# EAGLE board evpr_mainboard (EAGLE 9.5.2)
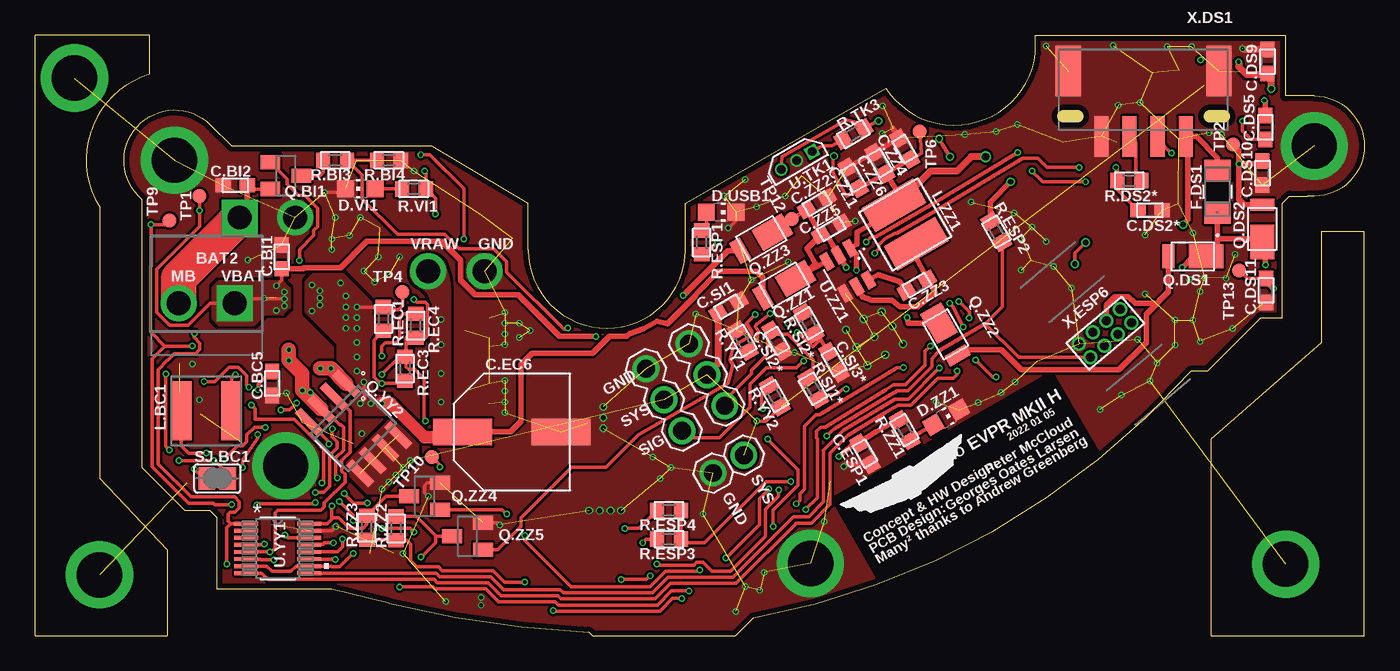
[diagram p2: board, top side]
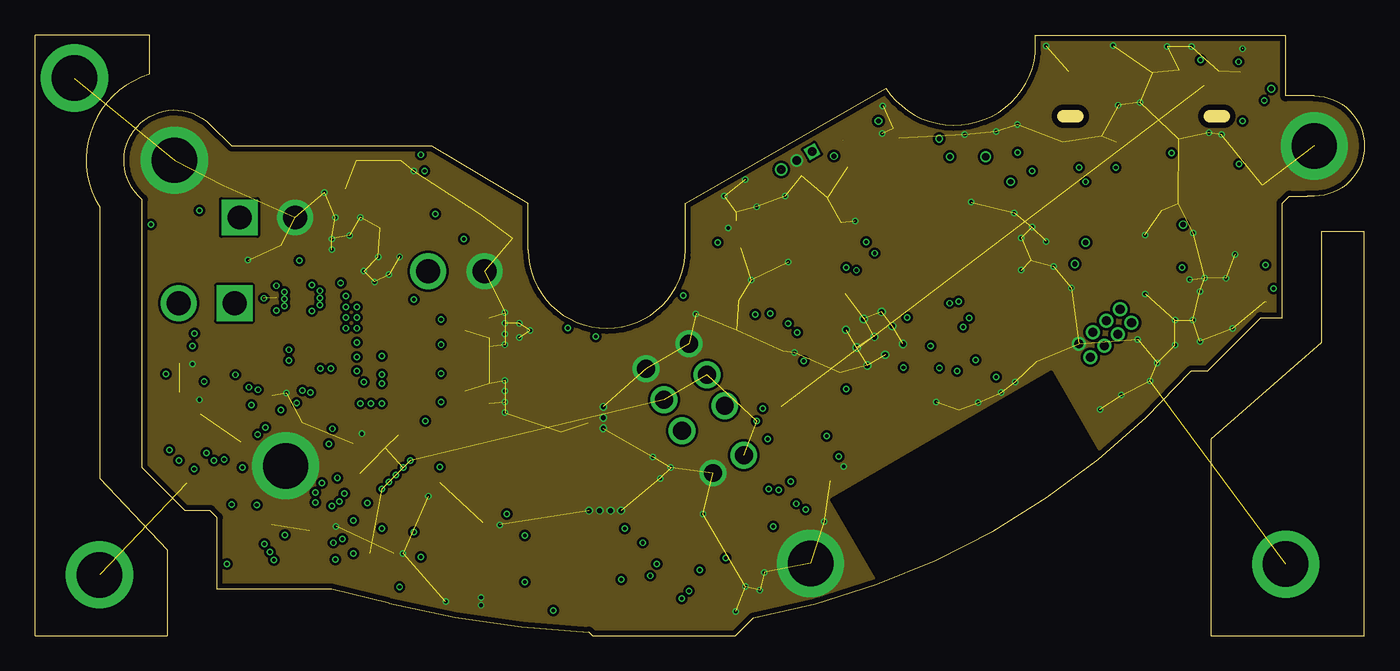
[diagram p3: board, inner layer Route2]
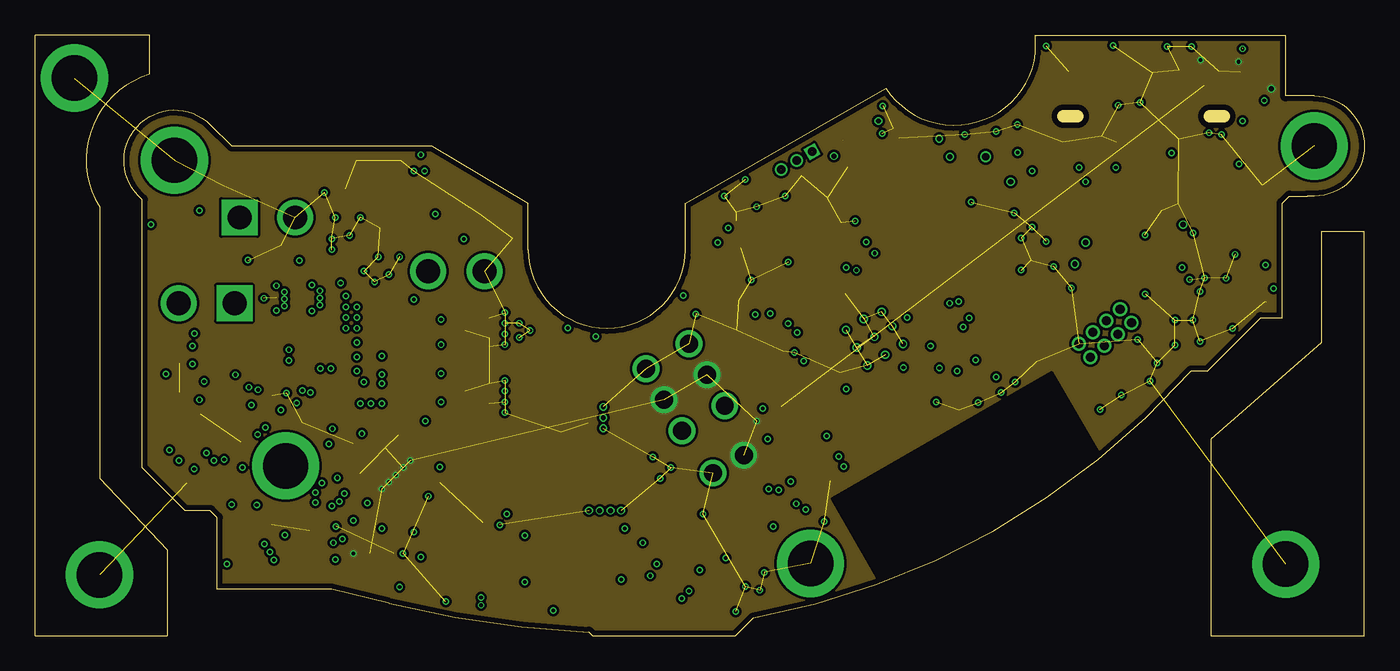
[diagram p4: board, inner layer Route15]
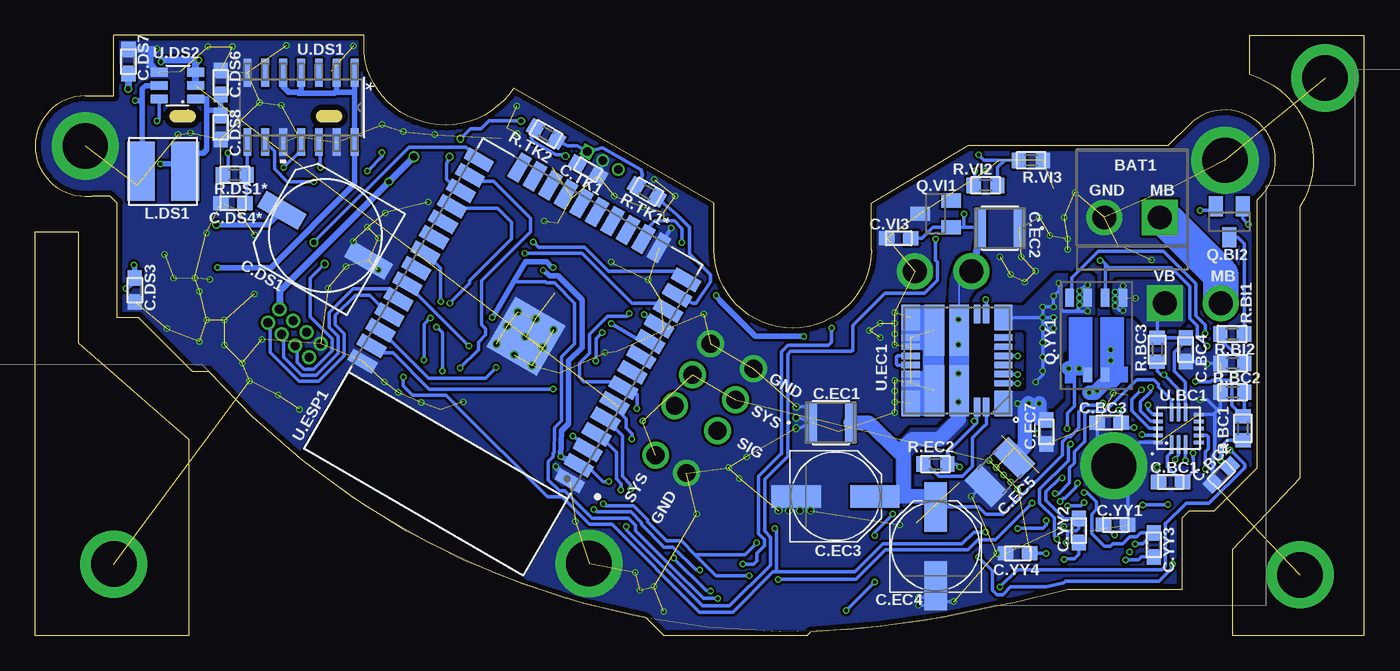
[diagram p5: board, bottom side, seen from below]

Size 94.49 x 42.67 mm. Coordinates in mm from the lower left corner, seen from the top.
Outline: 51.05,1.27 arc38 82.16,18.8 83.31,18.8 87.12,22.61 88.65,22.61 88.65,30.73 89.15,31.24 90.42,31.24 90.93,31.24 arc180 90.93,38.35 88.9,38.35 88.9,42.67 71.12,42.67 71.12,41.4 arc-140 60.48,38.91 46.23,30.73 46.23,27.43 arc-180 35.05,27.43 35.05,30.73 28.19,34.8 13.97,34.8 12.45,36.32 arc185 7.62,30.99 7.62,11.94 10.67,8.89 12.45,8.89 12.95,8.38 12.95,3.3 21.08,3.3 25.15,2.29 arc11 39.37,0.25 39.62,0 49.78,0 51.05,1.27
Outline: 0,0 0,42.67 8.13,42.67 8.13,39.88 arc105 4.57,30.48 4.57,11.18 9.4,6.1 9.4,0 0,0
Outline: 83.57,0 94.49,0 94.49,28.7 91.44,28.7 91.44,20.83 83.57,13.97 83.57,0
Copper layers (1*2*15*16): Top 0.035559375mm / dielectric 0.17018125mm / Route2 0.01778125mm / dielectric 47mil / Route15 0.01778125mm / dielectric 0.17018125mm / Bottom 0.035559375mm
Design rules "oshpark-4layer *": minimum track width 5mil, minimum drill 10mil, track to track 7mil, track to pad 7mil, pad to pad 7mil, via to via 7mil, smd to smd 5mil, copper to edge 15mil, drill to drill 6mil, minimum pad ring 4mil, minimum via ring 4mil, stop-mask expansion 2.5mil, vias tented up to drill 10mil, thermal gap 10mil

## Footprints (pad centres in the part's own frame; a part is rotated, then mirrored left to right if it is on the bottom)
C0603 = smd 1.1 x 1: 1 -0.85,0; 2 0.85,0
810RADCAN = smd 1.3 x 3.3: A$1 0,3.556; C$2 0,-3.556
CAP_3225 = smd 0.75 x 2.794: 1 -1.375,0; 2 1.375,0
OSCON_SVPF_6.3MM = smd 3.5 x 1.6: + 2.8,0; - -2.8,0
C1210 = smd 1.6 x 2.7: 1 -1.4,0; 2 1.4,0
C6CYLCAP = smd 4.2 x 1.9: P$1 -3.5,0; P$2 3.5,0
CHIP-LED0805 = smd 1.2 x 1.2: A 0,-1.05; C 0,1.05
C1-M = smd 1.473 x 1.88: 1 -1.524,0; 2 1.524,0
SRN5040TA = smd 1.5 x 4.2: P$1 -1.8,0; P$2 1.8,0
SRR4818A-XXXX = smd 4.2 x 1.98: P$1 0,1.575; P$2 0,-1.575
SOT23 = smd 1 x 1.4: 1 -0.95,-1.1; 2 0.95,-1.1; 3 0,1.1
SOD-123HE1 = smd 0.85 x 1.7: A 1.725,0 | smd 2.45 x 1.7: C -0.925,0
POWERPAK_SO8DUAL = smd 1.02 x 0.61: D$1B 2.795,0.635; D$2A 2.795,-0.635 | smd 1.27 x 0.61: P$1 -2.67,1.905; P$2 -2.67,0.635; P$3 -2.67,-0.635; P$4 -2.67,-1.905
SOIC8 = smd 0.6 x 2.2: 1 -1.905,-2.6; 2 -0.635,-2.6; 3 0.635,-2.6; 4 1.905,-2.6; 5 1.905,2.6; 6 0.635,2.6; 7 -0.635,2.6; 8 -1.905,2.6
R0603 = smd 1 x 1.1: 1 -0.85,0; 2 0.85,0
SJ = smd 1.168 x 1.6: 1 -0.762,0; 2 0.762,0
MA03-1 = drill 1.27 pad 1.905: 1 -2.54,0; 2 0,0; 3 2.54,0
1X02 = drill 1.27 pad 1.905: 1 -1.27,0; 2 1.27,0
TP10R = smd 1 x 1: TP 0,0
QFN16 = smd 0.25 x 0.7: !ACOK 1,1.45; !EN 0,-1.45; AGND 1,-1.45; BST -0.5,1.45; CELL -1,-1.45; NC 0.5,-1.45; NTC 0.5,1.45; PGND -1,1.45; SEL -0.5,-1.45; TMR 0,1.45 | smd 1.3 x 0.25: !CHOK 1.15,0.5; BAT 1.15,-0.5; CSP 1.15,0; SW -1.15,0.5; VCC -1.15,-0.5; VIN -1.15,0
D14 = smd 1.981 x 0.559: 1 -2.464,3.81; 2 -2.464,2.54; 3 -2.464,1.27; 4 -2.464,0; 5 -2.464,-1.27; 6 -2.464,-2.54; 7 -2.464,-3.81; 8 2.464,-3.81; 9 2.464,-2.54; 10 2.464,-1.27; 11 2.464,0; 12 2.464,1.27; 13 2.464,2.54; 14 2.464,3.81
TSOT23-6 = smd 0.62 x 1.22: 1 -0.95,-1.3; 2 0,-1.3; 3 0.95,-1.3; 4 0.95,1.3; 5 0,1.3; 6 -0.95,1.3
MOL0024A = smd 1.3 x 1.8: 1 -3.3,3.05; 8 -3.3,-3.05; 13 3.3,-3.05; 20 3.3,3.05 | smd 1.3 x 0.45: 2 -3.3,1.625; 3 -3.3,0.975; 4 -3.3,0.325; 5 -3.3,-0.325; 6 -3.3,-0.975; 7 -3.3,-1.625; 14 3.3,-1.625; 15 3.3,-0.975; 16 3.3,-0.325; 17 3.3,0.325; 18 3.3,0.975; 19 3.3,1.625 | smd 0.45 x 1.3: 9 -2.075,-3.3; 10 -1.425,-3.3; 23 -1.425,3.3; 24 -2.075,3.3 | smd 1.4 x 3.6: 11 -0.15,-2.15; 12 1.6,-2.15; 21 1.6,2.15; 22 -0.15,2.15
MODULE_ESP32-WROOM-32D = smd 2 x 0.9: 1 -8.5,5.26; 2 -8.5,3.99; 3 -8.5,2.72; 4 -8.5,1.45; 5 -8.5,0.18; 6 -8.5,-1.09; 7 -8.5,-2.36; 8 -8.5,-3.63; 9 -8.5,-4.9; 10 -8.5,-6.17; 11 -8.5,-7.44; 12 -8.5,-8.71; 13 -8.5,-9.98; 14 -8.5,-11.25; 25 8.5,-11.25; 26 8.5,-9.98; 27 8.5,-8.71; 28 8.5,-7.44; 29 8.5,-6.17; 30 8.5,-4.9; 31 8.5,-3.63; 32 8.5,-2.36; 33 8.5,-1.09; 34 8.5,0.18; 35 8.5,1.45; 36 8.5,2.72; 37 8.5,3.99; 38 8.5,5.26 | smd 0.9 x 2: 15 -5.715,-12.25; 16 -4.445,-12.25; 17 -3.175,-12.25; 18 -1.905,-12.25; 19 -0.635,-12.25; 20 0.635,-12.25; 21 1.905,-12.25; 22 3.175,-12.25; 23 4.445,-12.25; 24 5.715,-12.25 | smd 4.1 x 4.1: 39 -0.68,-2.08
1.27MMHALLEFECT = drill 0.6 square: P$1 1.27,0 | drill 0.6: P$2 0,0; P$3 -1.27,0
MSOP-16_MS-M = smd 1.702 x 0.279: 1 -2.235,1.751; 2 -2.235,1.251; 3 -2.235,0.751; 4 -2.235,0.25; 5 -2.235,-0.25; 6 -2.235,-0.751; 7 -2.235,-1.251; 8 -2.235,-1.751; 9 2.235,-1.751; 10 2.235,-1.251; 11 2.235,-0.751; 12 2.235,-0.25; 13 2.235,0.25; 14 2.235,0.751; 15 2.235,1.251; 16 2.235,1.751
B2P-VH(LF)(SN) = drill 1.7 square: 1 -1.98,0 | drill 1.7: 2 1.98,0
BM04B-PASS-1-TFT(LF)(SN) = smd 1 x 2.9: P$1 -3,2.5; P$2 -1,2.5; P$3 1,2.5; P$4 3,2.5 | smd 1.8 x 3.6: P$5 5.35,-2.15; P$6 -5.35,-2.15
PR20B04HBDN = drill 0.65 pad 1: P$1 -1.905,-0.635; P$2 -1.905,0.635; P$3 -0.635,-0.635; P$4 -0.635,0.635; P$5 0.635,-0.635; P$6 0.635,0.635; P$7 1.905,-0.635; P$8 1.905,0.635
2-THROUGH-HOLE-LARGE-OFFSET = drill 1.7: 1 4,0; 2 0,0

## Placement (x,y rotation side)
C.BC1  0.1uF  [C0603]  13.77,10.92 0 bottom
C.BC2  0.1uF  [C0603]  10.16,11.43 45 bottom
C.BC3  22uF  [C0603]  18.14,15.14 180 bottom
C.BC4  22uF  [C0603]  12.7,20.32 270 bottom
C.BC5  0.47uF  [C0603]  16.84,17.93 90 top
C.BI1  0.1uF  [C0603]  17.53,26.92 90 top
C.BI2  0.1uF  [C0603]  14.22,32 180 top
C.DS1  1000µF  [810RADCAN]  73.86,28.45 60 bottom
C.DS2*  0.1uF  [C0603]  79.25,30.23 0 top
C.DS3  0.1uF  [C0603]  87.4,24.56 90 bottom
C.DS4*  0.1uF  [C0603]  80.42,30.72 180 bottom
C.DS5  0.1uF  [C0603]  87.45,36.12 90 top
C.DS6  22uF  [C0603]  81.31,39.32 90 bottom
C.DS7  10uF  [C0603]  87.86,40.79 90 bottom
C.DS8  22uF  [C0603]  81.31,36.12 270 bottom
C.DS9  0.1uF  [C0603]  87.6,40.79 270 top
C.DS10  0.1uF  [C0603]  87.25,32.87 90 top
C.DS11  0.1uF  [C0603]  87.5,24.54 90 top
C.EC1  10µF  [CAP_3225]  37.92,15.14 0 bottom
C.EC2  10µF  [CAP_3225]  25.91,28.96 180 bottom
C.EC3  56µF  [OSCON_SVPF_6.3MM]  37.59,9.91 0 bottom
C.EC4  56µF  [OSCON_SVPF_6.3MM]  30.48,6.35 90 bottom
C.EC5  47µF  [C1210]  25.91,11.63 225 bottom
C.EC6  220µF  [C6CYLCAP]  33.88,14.48 180 top
C.EC7  0.1uF  [C0603]  22.61,14.48 90 bottom
C.ESP1  0.1uF  [C0603]  58.98,12.93 120 top
C.SI1  0.1uF  [C0603]  49.28,23.37 210 top
C.SI2*  0.1uF  [C0603]  52.73,20.95 300 top
C.SI3*  0.1uF  [C0603]  56.79,19.43 300 top
C.TK1  0.1uF  [C0603]  55.19,33.12 150 bottom
C.VI3  0.1uF  [C0603]  33.1,28.24 180 bottom
C.YY1  0.1uF  [C0603]  17.68,7.87 0 bottom
C.YY2  56 nF  [C0603]  20.29,7.47 90 bottom
C.YY3  56 nF  [C0603]  14.96,6.45 270 bottom
C.YY4  0.1uF  [C0603]  24.64,5.84 180 bottom
C.ZZ1  22uF  [C0603]  58.17,32.54 120 top
C.ZZ2  10uF  [C0603]  55.57,30.7 30 top
C.ZZ3  0.1uF  [C0603]  62.68,24.91 30 top
C.ZZ4  22uF  [C0603]  61.81,34.6 120 top
C.ZZ5  0.1uF  [C0603]  56.58,28.9 210 top
C.ZZ6  0.1uF  [C0603]  60.05,33.58 300 top
D.USB1  [CHIP-LED0805]  48.76,30.1 270 top
D.VI1  [CHIP-LED0805]  23.11,31.75 90 top
D.ZZ1  [CHIP-LED0805]  64.77,15.52 300 top
F.DS1  1A  [C1-M]  84.05,31.55 90 top
L.BC1  33uH  [SRN5040TA]  12.17,15.98 0 top
L.DS1  4.7µH  [SRR4818A-XXXX]  85.39,32.99 90 bottom
L.ZZ1  3.9µH  [SRR4818A-XXXX]  61.85,29.22 210 top
Q.BI1  BSS84-7-F  [SOT23]  17.83,32.69 270 top
Q.BI2  BSS84-7-F  [SOT23]  9.6,29.41 180 bottom
Q.DS1  SMD34LHE1  [SOD-123HE1]  82.3,26.95 180 top
Q.DS2  SMD34LHE1  [SOD-123HE1]  87.22,28.91 90 top
Q.VI1  [SOT23]  30.48,29.97 90 bottom
Q.YY1  SI7997DP  [POWERPAK_SO8DUAL]  19.05,21.34 270 bottom
Q.YY2  CSD88537NDT  [SOIC8]  22.61,14.73 225 top
Q.ZZ1  SMD34LHE1  [SOD-123HE1]  53.24,24.92 210 top
Q.ZZ2  SMD34LHE1  [SOD-123HE1]  64.72,21.41 300 top
Q.ZZ3  SMD34LHE1  [SOD-123HE1]  51.61,28.22 210 top
Q.ZZ4  DMN5L06K-7  [SOT23]  27.69,9.91 90 top
Q.ZZ5  DMN5L06K-7  [SOT23]  30.73,7.06 90 top
R.BC1  100k  [R0603]  8.64,14.73 270 bottom
R.BC2  100k  [R0603]  9.37,17.3 0 bottom
R.BC3  0.25  [R0603]  14.73,20.32 90 bottom
R.BI1  47.5k  [R0603]  9.4,21.44 0 bottom
R.BI2  22.1k  [R0603]  9.37,19.35 0 bottom
R.BI3  47.5k  [R0603]  21.34,33.78 180 top
R.BI4  22.1k  [R0603]  25.15,33.78 180 top
R.DS1*  0  [R0603]  80.29,32.74 0 bottom
R.DS2*  0  [R0603]  77.77,32.33 180 top
R.EC1  10k 0.1%  [R0603]  24.77,22.5 270 top
R.EC2  37.4kΩ 1%  [R0603]  30.48,12.19 180 bottom
R.EC3  768Ω 0.1%  [R0603]  26.29,18.97 270 top
R.EC4  95.3kΩ  [R0603]  27.05,22.02 270 top
R.ESP1  250Ω  [R0603]  47.37,27.94 270 top
R.ESP2  10k  [R0603]  68.33,28.7 300 top
R.ESP3  100k  [R0603]  45.06,6.85 180 top
R.ESP4  100k  [R0603]  45.06,8.9 180 top
R.SI1*  0  [R0603]  55.3,17.55 300 top
R.SI2*  0  [R0603]  54.99,22.2 120 top
R.TK1*  0  [R0603]  51,31.55 330 bottom
R.TK2  0  [R0603]  58.17,35.64 150 bottom
R.TK3  100k  [R0603]  58.17,35.64 30 top
R.VI1  500  [R0603]  26.92,31.75 0 top
R.VI2  100k  [R0603]  26.92,32 180 bottom
R.VI3  22.1k  [R0603]  23.7,33.78 180 bottom
R.YY1  22.1k  [R0603]  50.29,20.95 300 top
R.YY2  100k  [R0603]  52.58,17.02 300 top
R.ZZ1  250Ω  [R0603]  61.8,14.6 120 top
R.ZZ2  100k  [R0603]  25.65,7.62 90 top
R.ZZ3  100k  [R0603]  23.57,7.67 90 top
SJ.BC1  [SJ]  12.95,11.18 0 top
SV1  [MA03-1]  44.7,16.76 120 top
SV2  [MA03-1]  47.75,18.54 120 top
SV3  [1X02]  49.28,12.19 30 top
TP1  PTR1TP10R  [TP10R]  11.68,31.24 90 top
TP2  PTR1TP10R  [TP10R]  85.14,34.9 90 top
TP4  PTR1TP10R  [TP10R]  26.11,24.43 180 top
TP6  PTR1TP10R  [TP10R]  62.89,35.81 0 top
TP9  PTR1TP10R  [TP10R]  9.55,29.51 90 top
TP10  PTR1TP10R  [TP10R]  28.19,12.7 180 top
TP12  PTR1TP10R  [TP10R]  53.77,29.6 30 top
TP13  PTR1TP10R  [TP10R]  85.6,25.96 90 top
U.BC1  MP2615  [QFN16]  13.21,14.73 90 bottom
U.DS1  SN74AHCT125DR  [D14]  75.59,37.54 270 bottom
U.DS2  [TSOT23-6]  84.38,39.09 90 bottom
U.EC1  TPSM84824MOLR  [MOL0024A]  28.96,19.56 180 bottom
U.ESP1  ESP32-WROOM-32D  [MODULE_ESP32-WROOM-32D]  61.21,19.81 150 bottom
U.TK1  HALLEFFECT  [1.27MMHALLEFECT]  54.13,33.76 30 top
U.YY1  LTC4353CMSPBFMSOP-16_MS-M  [MSOP-16_MS-M]  17.25,6.2 0 top
U.ZZ1  [TSOT23-6]  57.75,25.93 210 top
X.BI1  B2P-VH(LF)(SN)  [B2P-VH(LF)(SN)]  12.19,23.62 180 top
X.BI2  B2P-VH(LF)(SN)  [B2P-VH(LF)(SN)]  16.51,29.72 180 bottom
X.DS1  BM04B-PASS-1-TFT(LF)(SN)  [BM04B-PASS-1-TFT(LF)(SN)]  78.79,37.97 180 top
X.ESP6  PR20B04HBDN  [PR20B04HBDN]  76.07,21.49 40 top
X.VI1  2-THROUGHOLE-OFFSET  [2-THROUGH-HOLE-LARGE-OFFSET]  27.94,25.91 0 top

## Tracks (layer width: path | path; a pad name or v marks a point on that pad's centre or on a via)
5.0V  (via drill 0.25)
  Top 0.254: TP13.TP 86.16,25.4 87.47,25.4 C.DS11.2
  Top 0.381: v81.53,26.16 82.32,26.95 Q.DS1.C 84.05,27.78 84.05,28.19 | F.DS1.1 84.05,28.19 | 84.05,28.19 87.01,28.19 Q.DS2.C 87.45,27.75 v87.45,26.34 | v88.02,24.67 87.47,25.22 87.47,25.4
  Bottom 0.381: 71.78,38.61 U.DS1.14 71.78,32.11 77.72,26.16 v81.53,26.16 | 71.78,38.61 U.DS1.1 | U.DS1.5 76.86,39.01 76.45,38.61 75.69,38.61 | 71.78,38.61 73.15,38.61 | U.DS1.2 73.05,38.71 73.15,38.61 | 73.15,38.61 73.2,38.56 75.74,38.56 75.69,38.61 | U.DS1.4 75.59,38.71 75.69,38.61 | v87.45,26.34 87.4,26.29 C.DS3.2 87.4,25.29 v88.02,24.67
!ACOK  (via drill 0.25)
  Top 0.254: v15.38,16.4 15.65,16.13 15.65,15.36 18.43,15.36 19.86,13.93 19.89,13.93 20.34,13.48 20.34,13.39 20.5,13.24 20.5,10.95 v20.4,10.85 | v21.64,9.52 22.61,8.56 v22.61,8.18 | v24.64,7.62 26.67,7.62 v26.92,7.37 | v65.66,23.75 66.4,23.01 v66.4,22.59 | v68.33,18.38 68.07,18.38 v66.84,19.6 | R.ESP4.2 42.92,7.62 v41.91,7.62
  Bottom 0.254: U.BC1.!ACOK 15.02,15.73 15.38,16.09 v15.38,16.4 | v20.4,10.85 20.52,10.72 20.52,10.53 21.3,9.76 21.41,9.76 v21.64,9.52 | v22.61,8.18 22.61,7.87 22.86,7.62 v24.64,7.62 | v26.92,7.37 27.76,7.37 28.6,6.53 34.22,6.53 36.2,4.54 41.66,4.54 | U.ESP1.31 65.66,26.11 v65.66,23.75 | v66.4,22.59 66.84,22.15 v66.84,19.6 | v68.33,18.38 68.33,17.75 67.67,17.09 65.28,17.09 64.59,16.41 64.59,16.39 58.06,9.86 57.03,9.86 55.09,7.92 53.49,7.92 47.25,1.68 44.89,1.68 42.03,4.54 41.66,4.54 | v41.91,7.62 41.78,7.49 41.78,4.67 41.66,4.54
!BAT_EN  (via drill 0.25)
  Top 0.254: Q.BI1.1 17.93,32.45 17.93,32.06 18.69,31.3 19.14,31.3 20.07,30.37 20.07,29.06 19.81,28.81 19.81,28.45 18.8,27.43 v18.8,26.67 | Q.ZZ4.3 24.96,9.91 R.ZZ3.2 23.57,7.91 23.3,7.65 22.33,7.65 21.59,8.38 21.19,8.38 | 21.19,8.38 21.08,8.38 v21.08,9.22 | 21.19,8.38 20.75,7.95 U.YY1.16 | v11.18,20.57 9.22,20.57 | 9.22,20.57 8.32,19.68 8.32,11.99 10.9,9.41 12.66,9.41 12.76,9.31 v13.97,9.31 | 9.22,20.57 8.2,21.59 8.2,26.23 8.24,26.27 v8.24,29.21 9.25,29.21 TP9.TP | v15.75,9.27 15.85,9.37 18.92,9.37 18.93,9.38 19.84,9.38 v19.91,9.46
  Bottom 0.254: Q.YY1.P$2 18.41,26.42 | v18.8,26.67 18.67,26.67 18.41,26.42 | 18.41,26.42 18.16,26.16 13.73,26.16 12.4,24.83 12.4,22.56 11.86,22.02 11.86,21.26 v11.18,20.57 | Q.BI2.1 8.65,29.62 v8.24,29.21 | v13.97,9.31 15.71,9.31 v15.75,9.27 | v21.08,9.22 20.15,9.22 v19.91,9.46
!CHGOK  (via drill 0.25)
  Top 0.254: v61.72,19.05 61.21,19.05 61.15,18.98 55.76,15.69 55.5,15.69 54.83,15.02 54.68,14.87 54.68,10.39 54.37,10.08 54.37,9.64 v54.1,9.37 | v21.98,10.09 22.64,9.43 v23.62,9.43 | v43.73,4.26 43.48,4.01 v41.66,4.01 | v43.18,6.6 43.43,6.85 R.ESP3.2
  Bottom 0.254: U.ESP1.36 66.52,18.29 62.48,18.29 v61.72,19.05 | U.BC1.!CHOK 13.71,16.76 14.66,17.7 14.66,17.87 14.97,18.19 16.15,18.19 18.4,15.94 19.66,15.94 19.86,15.74 19.86,13.81 20.61,13.07 20.61,12.27 20.96,11.92 20.96,10.86 21.73,10.09 v21.98,10.09 | v23.62,9.43 26.22,6.83 27.46,6.83 28.19,6.1 34.04,6.1 36.13,4.01 v41.66,4.01 | 54.1,9.4 v54.1,9.37 53.95,9.22 51.95,9.22 50.95,8.22 50.95,8.08 49.6,6.73 48.54,6.73 47.58,5.76 | v43.73,4.26 46.07,4.26 47.58,5.76 | 47.58,5.76 44.02,5.76 v43.18,6.6
!ENG_EN  (via drill 0.25)
  Top 0.254: Q.ZZ5.3 28.45,7.06 | R.ZZ2.2 27.09,8.47 28.45,7.11 28.45,7.06 | v11.31,21.46 11.31,21.2 11.71,20.8 11.71,20.35 11.4,20.04 9.89,20.04 9.41,19.56 9.4,19.56 8.75,18.91 8.75,12.19 11.08,9.87 14.17,9.87 14.5,9.53 14.5,9.09 14.19,8.78 13.86,8.78 13.72,8.64 13.72,8.36 13.73,8.34 13.73,8.13 13.91,7.95 | 13.91,7.95 U.YY1.1 15.68,7.95 | 13.91,7.95 13.62,7.66 v13.62,5.08 | 28.45,7.06 28.45,6.6 v27.43,5.59
  Bottom 0.254: v11.31,21.46 v11.3,21.46 11.3,22.07 11.97,22.74 11.97,25.01 14.29,27.33 18.89,27.33 20.78,25.44 20.78,24.18 Q.YY1.P$4 | v13.62,5.08 13.72,4.98 13.72,4.75 14.61,3.86 21.26,3.86 21.35,3.77 22.6,3.46 25.15,3.46 25.69,2.92 26.13,2.92 26.44,3.24 26.44,4.6 v27.43,5.59
!USING_BAT  (via drill 0.25)
  Top 0.254: U.YY1.9 22.93,4.45 28.5,4.45 28.77,4.18 32.39,4.18 33.3,3.28 37.33,3.28 37.56,3.04 43.88,3.04 44.98,4.14 49.6,4.14 53.9,8.44 54.99,8.44 56.05,9.5 56.05,13.17 57.47,14.59 61.13,16.82 62.07,16.82 64.18,18.92 v64.28,19.02
  Bottom 0.254: v64.28,19.02 62.97,20.33 62.97,20.86 62.46,21.37 62.46,21.81 62.74,22.09 62.74,25.21 59.26,28.69 59.26,29.65 61.91,32.3 63.18,32.3 U.ESP1.26
!USING_ENG  (via drill 0.25)
  Top 0.254: U.YY1.8 16.1,4.45 16.55,3.99 28.35,3.99 28.59,3.75 32.21,3.75 33.12,2.84 37.15,2.84 37.38,2.61 44.05,2.61 45.16,3.71 49.81,3.71 54.1,8 | 54.08,8 54.1,8 | 54.1,8 55.17,8 56.49,9.33 56.49,12.97 57.77,14.25 60.41,15.83 61.32,16.38 62.25,16.38 64.16,18.29 65.28,18.29 65.53,18.54 v65.53,18.82 | v65.02,23.62 65.23,23.42 v65.96,21.95
  Bottom 0.254: v65.53,18.82 65.53,21.51 v65.96,21.95 | v65.02,23.62 63.6,25.04 63.6,25.22 60.63,28.19 60.63,29.39 61.63,30.39 64.72,30.39 64.84,30.5 U.ESP1.28
AGND  (via drill 0.25)
  Top 0.254: v24.64,18.57 25.89,19.82 R.EC3.1 26.38,19.92 | v26.92,23.88 27.12,23.68 27.73,23.68 27.91,23.5 27.91,21.34 27.74,21.17 R.EC4.2 26.38,21.17 26.38,19.92 | v27.73,15.25 27.65,15.34 27.65,18.24 26.96,18.93 26.54,18.93 26.38,19.08 26.38,19.92 | TP10.TP 28.75,12.14 v28.75,11.99
  Bottom 0.254: U.EC1.3 24.64,18.58 v24.64,18.57 | U.EC1.23 27.53,15.14 | U.EC1.9 26.88,23.83 v26.92,23.88 | 27.53,15.14 29.63,13.04 R.EC2.1 28.96,12.19 v28.75,11.99 | 27.53,15.14 27.64,15.25 v27.73,15.25
BAT_EN  (via drill 0.25)
  Top 0.254: v54.77,8.97 55.61,9.81 55.61,14 55.55,14.07 55.55,14.52 55.86,14.83 56.2,14.83 56.25,14.85 56.23,14.85 60.49,17.47 61.01,17.83 61.87,17.83 63.26,19.23 63.26,20.2 v63.64,20.58 | Q.ZZ4.1 33.21,8.96 v33.53,8.64 | 34.84,7.12 v34.8,7.12 34.8,6.77 38.1,3.47 43.7,3.47 44.8,4.57 47.14,4.57 v47.24,4.67
  Bottom 0.254: v54.77,8.97 54.59,8.79 52.13,8.79 51.38,8.04 51.38,7.9 49.78,6.3 49.13,6.3 47.51,4.67 v47.24,4.67 | U.ESP1.33 68.03,24.97 v63.64,20.58 | v33.53,8.64 34.8,7.37 v34.8,7.12
BATSENSE1  (via drill 0.25)
  Top 0.254: v9.29,18.6 9.29,13.45 v9.56,13.18 | v25.91,3.46 28.27,3.46 28.41,3.32 32.03,3.32 32.94,2.41 36.97,2.41 37.2,2.18 44.23,2.18 45.23,3.17 v46.48,3.17 | v52.16,10.41 51.49,9.74 51.49,7.9 v49.1,5.51
  Bottom 0.254: R.BI1.1 10.25,21.08 R.BI2.2 v9.28,18.6 v9.29,18.6 | v9.56,13.18 9.5,13.18 8.51,12.19 8.51,11.94 11.04,9.41 12.66,9.41 14.09,7.98 14.16,7.98 14.16,4.92 14.38,4.7 24.67,4.7 v25.91,3.46 | v52.16,10.41 52.16,10.73 52.74,11.31 52.74,14.21 U.ESP1.5 | v46.48,3.17 46.77,3.17 v49.1,5.51
BATSENSE2  (via drill 0.25)
  Top 0.254: R.BI4.2 R.BI3.1 23.26,32.71 23.26,31.02 25.77,28.52 29.11,28.52 30.13,27.49 32.59,27.49 33.52,26.56 33.52,25.83 37.59,21.76 37.76,21.76 v37.86,21.86 | v52.85,10.34 52.85,9.92 51.92,8.99 51.92,7.07 49.42,4.57 48.1,4.57 47.47,5.21 47.02,5.21 46.82,5 44.27,5 v44.2,5.08
  Bottom 0.254: U.ESP1.4 54.44,14.31 53.18,13.04 53.18,11.13 52.85,10.8 v52.85,10.34 | v37.86,21.86 37.86,20.85 38.08,20.63 40.96,20.63 41.42,20.17 41.42,12.95 | 41.42,12.95 41.42,12.94 | 41.42,12.95 43.05,11.32 43.05,7.23 42.65,6.83 42.65,6.38 43.18,5.85 43.18,5.33 43.43,5.08 v44.2,5.08
BOOTMODE  (via drill 0.38)
  Top 0.254: v73.91,26.42 73.91,27.18 v74.68,27.94
  Bottom 0.254: X.ESP6.P$3 75.85,20.45 75.85,19.43 75.37,18.95 74.68,18.95 73.38,20.25 73.38,21.09 74.93,22.65 74.93,25.4 v73.91,26.42 | v74.68,27.94 67.9,34.72 64.77,34.72 64.14,34.72 63.87,34.72 U.ESP1.25
DS_CLK  (via drill 0.25)
  Top 0.254: v59.07,27.98 59.43,28.35 59.78,28.35 63.64,30.57 69.81,34.31 v69.83,34.32 | v74.68,32.26 71.63,32.26 v70.87,33.02
  Bottom 0.254: v59.07,27.98 58.69,27.61 55.44,27.61 53.75,25.91 48.83,25.91 U.ESP1.14 | U.DS1.9 77.47,34.42 77.47,33.16 76.56,32.26 v74.68,32.26 | v70.87,33.02 69.83,34.06 v69.83,34.32
DS_DAT  (via drill 0.25)
  Top 0.254: v59.67,27.18 60,27.5 60,27.8 60.41,28.21 61.11,28.61 61.28,28.61 63.9,30.13 70.22,33.93 71.27,33.93 71.93,33.27 v74.22,33.27
  Bottom 0.254: U.ESP1.12 50.01,23.61 52.06,23.61 55.62,27.18 v59.67,27.18 | U.DS1.12 74.22,34.98 v74.22,33.27
ENG_EN  (via drill 0.25)
  Top 0.254: Q.ZZ5.1 32.88,6.11 34.54,7.78 34.54,8.38 38.12,11.95 40.58,11.95 42.89,14.26 49.25,17.94 49.6,19.25 49.39,19.61 49.66,20.61 50.89,21.31 50.95,21.55 50.57,22.2 v51.18,22.81
  Bottom 0.254: v51.18,22.81 50.38,22.01 U.ESP1.11
ESP_POWER  (via drill 0.25, 0.35, 0.38, 0.51)
  Top 0.254: TP6.TP 62.99,34.29 62.36,33.86 C.ZZ4.1 | v53.71,10.95 51.94,10.95 47.6,6.6 46.15,6.6 R.ESP3.1 R.ESP4.1 | C.ZZ1.1 57.66,31.24 56.71,32.91 56.71,34.04 v56.78,34.08
  Top 0.381: C.ZZ6.2 C.ZZ4.1 | C.ZZ6.2 61.65,30.98 61.53,30.9 L.ZZ1.P$2 60.75,30.4 60.56,30.29 59.62,29.35 58.42,28.66 58.42,27.8 U.ZZ1.1 58.39,27.07 v58.39,25.97 | C.ZZ1.1 C.ZZ6.2 | v57.12,12.73 58.25,13.66 C.ESP1.2 58.69,13.8 59.76,14.49 R.ZZ1.2 61.35,15.32 | R.ESP2.1 67.9,30.82 v69.34,32.26
  Top 0.508: v67.56,34.04 66.55,34.04 65.53,33.02 63.65,33.02 61.53,30.9
  Bottom 0.254: v53.71,10.95 54.13,10.95 55.29,12.11 U.ESP1.2 | v56.78,34.08 56.86,34.16 57.46,34.16 59.12,35.14 59.23,35.43 R.TK2.2
  Bottom 0.381: U.ESP1.2 55.99,12.24 v57.12,12.73 57.08,14.55 56.56,15.07 56.56,19.53 55.63,20.47 55.63,23.88 57.31,25.57 57.93,25.57 58.33,25.97 v58.39,25.97
  Bottom 0.508: X.ESP6.P$8 77.12,24.48 v69.34,32.26 v67.56,34.04
ESP_RX
  Bottom 0.254: U.ESP1.34 69.4,24.64 71.88,24.64 73.58,22.94 73.58,21.91 72.94,21.27 72.94,20.07 74.5,18.52 75.55,18.52 76.83,19.8 76.83,21.27 X.ESP6.P$5
ESP_TX
  Bottom 0.254: U.ESP1.35 70.7,24.21 71.7,24.21 73.15,22.76 73.15,22.09 72.51,21.45 72.51,19.89 74.32,18.08 75.72,18.08 77.8,20.16 77.8,22.08 X.ESP6.P$7
GND  (via drill 0.25, 0.35, 0.38, 3.23 pad 4.78)  (164 unrouted)
  Top 0.254: 49.81,29.49 v49.28,28.96 | 19.5,7.46 U.YY1.15 21.06,7.45 v21.39,7.77 | D.VI1.C 21.81,31.5 v20.57,31.5 | Q.ZZ4.2 27.87,10.86 27.69,10.67 27.69,10.16 v27.94,9.91 | Q.ZZ5.2 32.88,8.01 v33.02,7.87
  Top 0.381: 60.96,36.07 C.ZZ4.2 C.ZZ6.1 C.ZZ1.2 | v57.48,12.01 57.66,12.19 C.ESP1.1
  Top 0.508: C.DS9.1 85.91,41.64 85.84,41.72
  Bottom 0.254: 17.73,11.99 v17.8,12.06 18.99,13.24 C.BC3.2 | v49.28,28.96 U.ESP1.15 | v20.57,31.5 20.66,31.58 | U.BC1.AGND 10.68,15.73 10.41,16 | 10.41,16 10.22,16.19 R.BC2.1 10.22,16.23 10.62,15.84 10.62,12.9 10.76,12.76 C.BC2.1 | 10.41,16 11.18,16.76 v11.68,16.76 | R.BI2.1 11.12,19.35 v11.18,19.3 11.34,19.47 C.BC4.2 | U.BC1.PGND 15.99,13.73 17.73,11.99 | C.EC7.1 22.61,13.74 v23.22,14.35 | C.YY4.2 v26.15,5.84 | C.EC5.2 27.2,10.64 v27.94,9.91 | 30.48,2.79 C.EC4.- | v29.19,2.41 30.1,2.41 30.48,2.79 | v31.7,2.16 31.12,2.16 30.61,2.67 | 30.61,2.67 30.48,2.79 | v31.7,2.72 30.66,2.72 30.61,2.67 | C.YY1.2 16.83,11.09 17.73,11.99 | v40.39,15.49 40.16,15.49 C.EC1.1 | v40.39,14.73 40.21,14.73 C.EC1.1 | v39.37,8.89 C.EC3.- | v40.13,8.89 40.13,9.65 C.EC3.- | v40.89,8.89 40.89,9.4 C.EC3.- | v41.66,8.89 40.64,9.91 C.EC3.- | 39.88,16.26 v40.39,16.26 39.12,16.26 39.12,15.32 C.EC1.1 | U.TK1.P$2 C.TK1.1
  Bottom 0.381: U.ESP1.1 v57.48,12.01
  Bottom 0.508: C.DS7.2 85.89,41.64 v85.83,41.71 86.36,41.17 86.36,40.62 85.78,40.04 U.DS2.4
  other vias: 9.91,33.78 55.12,5.13 90.93,34.8 57.63,21.74 58.39,20.47 59.16,19.2 60.43,19.96 59.66,21.23 58.9,22.5 60.17,23.01 60.93,22 61.7,20.73 49.81,1.73 51.84,4.5 56.08,8.1 67.03,16.56 68.66,17.27 64.06,16.61 53.54,26.54 58.29,29.46 71.86,41.91 76.63,41.94 80.47,41.86 82.19,41.86 78.54,37.9 76.99,37.69 83.44,35.74 84.33,35.61 85.29,27.1 82.32,28.6 78.89,28.47 78.38,21.06 78.92,24.28 82.07,25.3 83.13,25.43 82.8,24.46 85.12,21.82 84.66,25.4 50.5,3.48 51.51,3.23 33.4,15.85 33.4,16.61 33.4,17.37 33.4,18.14 33.4,20.68 33.4,21.44 33.4,22.2 33.4,22.96 50.9,25.27 53.98,20.12 23.11,29.72 26.92,33.02 17.86,17.25 88.9,5.08 4.57,4.32 2.79,39.62 69.67,18.03 81.03,20.65 82.3,22.43 81.03,22.43 66.55,30.81 69.6,30.05 70.87,29.03 70.1,28.27 71.88,28.02 72.39,26.24 70.1,25.98 73.66,24.71 75.69,16.08 77.22,17.09 79.25,18.11 79.76,19.38 82.8,20.9 68.3,35.81 69.82,36.32 44.42,11.18 45.19,11.94 43.92,12.7 46.96,22.86 47.47,8.64 15.14,26.7 53.31,31.24 51.28,30.48 49,31.24 50.47,32.41 60.25,37.64 66.09,35.61 60.2,35.69 21.34,29.72 21.08,28.19 21.08,27.43 22.35,28.45 23.37,25.91 25.15,25.65 24.13,25.15 24.38,26.92 25.91,26.92 34.42,22.2 34.42,21.18 35.18,21.69
  pour Top (rank 2, no thermals): 7.62,30.99 7.37,31.24 arc-180 12.45,36.32 13.97,34.8 28.19,34.8 35.05,30.73 35.05,27.43 arc180 46.23,27.43 46.23,30.73 60.48,38.91 arc140 71.12,41.4 71.12,42.67 88.9,42.67 88.9,38.35 90.93,38.35 arc-180 90.93,31.24 88.65,31.24 88.65,22.61 87.12,22.61 83.31,18.8 82.16,18.8 arc-38 51.05,1.27 49.78,0 39.62,0 39.37,0.25 arc-11 25.15,2.29 21.08,3.3 13.21,3.3 13.21,8.13 12.45,8.89 10.67,8.89 7.62,11.94
  pour Bottom (rank 4, no thermals): 7.62,30.99 7.37,31.24 arc-180 12.45,36.32 13.97,34.8 28.19,34.8 35.05,30.73 35.05,27.43 arc180 46.23,27.43 46.23,30.73 60.48,38.91 arc140 71.12,41.4 71.12,42.67 88.9,42.67 88.9,38.35 90.93,38.35 arc-180 90.93,31.24 88.65,31.24 88.65,22.61 87.12,22.61 83.31,18.8 82.16,18.8 arc-38 51.05,1.27 49.78,0 39.62,0 39.37,0.25 arc-11 25.15,2.29 21.08,3.3 13.21,3.3 13.21,8.13 12.45,8.89 10.67,8.89 7.62,11.94
  cutout Top: 56.67,9.73 72.24,18.69 76.68,11.04 61.13,2
  cutout Bottom: 56.67,9.73 72.24,18.69 76.68,11.04 61.13,2
  cutout Route15: 56.67,9.73 72.24,18.69 76.68,11.04 61.13,2
  cutout Bottom (rank 3): 32.84,23.47 32.87,23.37 32.87,20.22 31.5,20.22 31.5,18.85 32.87,18.87 32.87,15.62 29.82,15.65 29.82,15.44 29.67,15.54 29.59,24.28 29.69,24.28 29.82,23.55 29.91,23.37
  pour Route2 (rank 4, no thermals): 7.62,30.99 7.37,31.24 arc-180 12.45,36.32 13.97,34.8 28.19,34.8 35.05,30.73 35.05,27.43 arc180 46.23,27.43 46.23,30.73 60.48,38.91 arc140 71.12,41.4 71.12,42.67 88.9,42.67 88.9,38.35 90.93,38.35 arc-180 90.93,31.24 88.65,31.24 88.65,22.61 87.12,22.61 83.31,18.8 82.16,18.8 arc-38 51.05,1.27 49.78,0 39.62,0 39.37,0.25 arc-11 25.15,2.29 21.08,3.3 13.21,3.3 13.21,8.13 12.45,8.89 10.67,8.89 7.62,11.94
HALL  (via drill 0.35)  (1 unrouted)
  Top 0.254: U.TK1.P$3 53.09,34.04 57.05,36.32 57.62,36.65 58.51,36.46 R.TK3.2 v59.94,36.58 | v65.02,34.04 v64.26,35.31
  Bottom 0.254: U.ESP1.27 64.44,31.61 65.26,32.43 65.26,33.55 v65.02,34.04 | v64.26,35.31 63.55,36.02 62.78,36.02 62.22,36.58 v59.94,36.58
HALL_EN
  Bottom 0.254: U.ESP1.13 47.75,23.62 47.5,23.62 46.48,25.15 46.48,25.62 46.49,25.65 47.98,27.14 47.98,29.03 48.88,29.92 R.TK1*.2
LED_BUILTIN  (via drill 0.25)
  Top 0.254: v48.51,27.94 47.66,27.09 R.ESP1.2
  Bottom 0.254: v48.51,27.94 48.49,27.96 48.49,28.92 49.05,29.49 50.42,29.49 51.24,28.67 U.ESP1.16
N$1  (2 unrouted)
  Top 0.254: U.TK1.P$1 55.96,34.8 56.64,34.8 R.TK2.1
  Bottom 0.254: R.TK2.1 56.64,34.8 55.96,34.8 U.TK1.P$1 | U.TK1.P$1 C.TK1.2 | R.TK1*.1 51.31,32.72 | 51.31,32.72 | 51.31,32.72 51.41,33.11 54.15,34.67 U.TK1.P$1
N$3  (via drill 0.25)
  Top 0.254: R.EC3.2 26.1,17.93 v24.64,17.93 24.54,18.04 24.42,18.04 24.11,18.35 24.11,20.99 R.EC1.2
  Bottom 0.254: U.EC1.2 v24.64,17.93
N$4  (via drill 0.25)
  Top 0.254: U.YY1.12 21.49,5.95 21.84,6.3 v21.84,6.86 | v20.88,13.61 20.88,13.77 Q.YY2.4
  Bottom 0.254: v20.88,13.61 21.04,13.45 21.04,12.44 23.09,10.39 23.09,9.42 22.05,8.38 22.05,7.06 v21.84,6.86
N$5  (via drill 0.25)
  Top 0.254: U.YY1.4 16.23,6.45 v16.31,6.53 | v19.91,10.19 20.5,10.19 20.93,10.62 20.93,12.81 21.46,13.34 21.46,13.79 21.13,14.13 v21.13,14.7
  Top 1.016: Q.YY2.1 v21.03,19 20.24,19
  Bottom 0.254: v16.31,6.53 15.73,6.53 C.YY3.1 15.89,7.3 16.17,7.03 16.68,7.03 17.17,6.54 17.87,6.54 18.05,6.35 18.5,6.35 19.38,7.24 19.38,8.64 19.05,8.97 19.05,9.5 19.74,10.19 v19.91,10.19 | v21.03,19 20.62,18.59 20.62,16.3 21.13,15.79 v21.13,14.7 | Q.YY1.D$2A 19.81,18.54 v20.27,19 20.04,19
  Bottom 1.016: 20.04,19 v21.03,19
N$6  (via drill 0.25)
  Top 0.254: U.YY1.13 19.54,6.5 20.46,6.5 20.56,6.6 v21.2,6.6 | v21.49,11.22 21.36,11.35 21.36,12.63 21.92,13.19 21.92,14.8 21.73,14.99 21.65,14.99 20.57,16.06 20.57,16.12 | 20.6,16.12 20.57,16.12 | 20.57,16.12 Q.YY2.3 20.32,16.51 v19.56,17.27
  Top 1.016: Q.YY2.3 20.29,16.12 v18.98,17.43 18.98,18.61 v18.03,19.56 v18.03,20.32
  Bottom 0.254: v21.2,6.6 21.1,6.71 21.1,7.29 20.92,7.47 20.47,7.47 20.3,7.65 C.YY2.2 21.32,8.32 22.63,9.63 22.63,10.21 21.62,11.22 v21.49,11.22 | v18.03,19.56 Q.YY1.D$1B | v18.98,17.43
  Bottom 0.381: v18.98,17.43 18.51,17.43 18.1,17.84 17.72,17.84 17.27,18.29 18.03,19.05 v18.03,19.56
  Bottom 1.016: 18.03,20 18.03,18.38 v18.98,17.43 | v18.98,17.43 19.14,17.27 v19.56,17.27
N$7  (via drill 0.25)
  Top 0.254: v15.85,17.48 15.85,17.88 16.75,18.78 C.BC5.2
  Bottom 0.254: v15.85,17.48 16.54,16.79 16.54,15.99 15.28,14.73 U.BC1.TMR
N$8
  Top 0.254: C.BI2.1 15.34,31.74 Q.BI1.2
  Top 0.381: X.BI2.1 15.07,30.26 C.BI2.1
  Top 2.54: X.BI2.1 10.21,25.4 X.BI1.2
  Bottom 2.54: X.BI1.2 10.21,25.65 14.28,29.72 X.BI2.1
N$9  (via drill 0.25)
  Top 0.254: C.ZZ2.1 TP12.TP 53.33,29.6 Q.ZZ3.C | R.ZZ3.1 25.6,6.82 R.ZZ2.1 26.42,6.77 26.69,6.5 26.69,5.32 27.12,4.88 28.68,4.88 28.95,4.62 32.57,4.62 33.37,3.81 v34.8,3.81 | v36.83,1.8 36.88,1.74 44.41,1.74 45.31,2.64 v45.97,2.64
  Top 0.381: C.ZZ5.2 54.86,27.49 55.49,26.42 54.45,25.38 Q.ZZ1.C 54.11,25.47 56.27,26.57 U.ZZ1.3 | C.ZZ5.2 56.39,28.27 U.ZZ1.2 v57.66,26.16 | C.ZZ5.2 C.ZZ2.1 | Q.ZZ2.C 62.07,22.21 v61.98,22.61
  Bottom 0.254: 60.47,25.16 58.22,25.16 58.13,25.07 57.58,25.07 56.13,23.62 56.13,20.74 57.06,19.81 57.06,15.28 57.57,14.76 57.57,14.56 57.61,12.99 57.66,12.95 57.66,12.73 58.01,12.38 58.01,12.08 58.02,12.08 58.01,12.07 58.01,11.09 57.22,10.3 56.85,10.3 54.91,8.36 52.31,8.36 51.82,7.86 51.82,7.47 49.23,4.88 46.99,2.64 v45.97,2.64 | v34.8,3.81 34.82,3.81 v36.83,1.8
  Bottom 0.381: v61.98,22.61 60.47,25.16 59.64,26.57 59.33,26.57 58.14,26.57 57.73,26.16 v57.66,26.16
N$10  (via drill 0.25)
  Top 0.254: U.YY1.5 v16.69,5.95 v16.7,5.96 16.75,5.96 17.06,6.26 17.06,8.72 17.23,8.9 20.31,8.9 20.55,9.14 20.55,9.44 22.02,10.91 22.02,11.46 21.79,11.69 21.79,12.45 22.38,13.03 22.38,15.94 21.29,17.02 Q.YY2.2
N$11
  Top 0.254: R.SI1*.1 55.3,18.72 55.3,19.62 53.51,21.41 52.58,21.41 C.SI2*.1 52.05,21.44 52.05,20 50.92,18.87 50.92,18.62 49.02,16.72 SV2.1
N$12  (via drill 0.25)
  Top 0.254: v54.18,21.54 54.26,21.54 55.28,20.52 55.7,20.93 | v54.63,19.53 54.13,19.02 51.99,19.02 50.83,17.86 50.83,16.25 48.66,14.08 46.46,14.08 SV1.1 | R.SI2*.1 55.72,20.95 55.7,20.93 | C.SI3*.1 55.84,21.07 55.7,20.93
  Bottom 0.254: v54.18,21.54 54.61,21.11 54.61,19.56 v54.63,19.53
N$13
  Bottom 0.254: R.BI1.2 8.55,27.85 9.01,28.31 Q.BI2.3
N$14
  Top 0.381: U.ZZ1.6 59.94,25.65 61.47,25.15 C.ZZ3.1
N$15
  Bottom 0.254: U.EC1.16 33.2,19.88 33.27,19.81 33.27,19.3 33.2,19.23 U.EC1.17
N$17
  Bottom 0.254: R.EC2.2 31.11,12.19 30.26,11.34 28.58,11.34 27.88,12.04 27.88,14.05 26.99,14.93 26.98,14.93 26.88,15.03 U.EC1.24
N$22  (via drill 0.25)
  Top 0.254: v76.82,33.27 76.92,33.17 R.DS2*.2 76.92,31.7 C.DS2*.1
  Bottom 0.254: v76.82,33.27 75.59,34.51 U.DS1.11
N$23
  Top 0.254: D.VI1.A R.VI1.1
N$24
  Top 0.254: R.ESP1.1 47.71,29.13 D.USB1.A
N$26
  Top 0.381: U.ZZ1.5 58.83,24.08 59.49,23.85 60.91,23.85 61.47,23.37 62.74,23.37 64.01,24.38 C.ZZ3.2 62.48,27.18 L.ZZ1.P$1
N$27
  Bottom 0.254: U.DS1.8 79.4,32.78 R.DS1*.2 79.44,30.85 C.DS4*.1
N$28  (via drill 0.38)
  Top 0.127: 81.94,34.44 X.DS1.P$1
  Top 0.381: F.DS1.2 84.05,33.98 82.55,35.47 X.DS1.P$1 | v81.61,29.21 81.94,29.55 81.94,34.44
  Bottom 0.381: v81.61,29.21 77.96,29.21 C.DS1.A$1
N$29  (via drill 0.25)
  Top 0.254: C.DS5.1 86.44,35.27 85.83,35.88 v85.83,36.58
  Bottom 0.254: v85.83,36.58 85.68,36.73 U.DS2.6
N$30  (via drill 0.25)
  Top 0.254: X.DS1.P$2 79.79,35.27 v80.77,34.29
  Bottom 0.254: R.DS1*.1 80.77,33.11 v80.77,34.29
N$31  (via drill 0.25)
  Top 0.254: v24.64,19.88 24.64,20.57 24.89,20.83 25.65,20.83 25.91,21.08 25.91,22.62 26.16,22.87 R.EC4.1
  Bottom 0.254: U.EC1.5 v24.64,19.88
N$32  (via drill 0.25)
  Top 0.254: U.YY1.14 17.96,6.95 v17.77,7.14
  Bottom 0.254: v17.77,7.14 17.8,7.14 C.YY1.1
N$33
  Top 0.254: Q.BI1.3 20.24,32.69 20.49,32.93 R.BI3.2
N$36
  Top 0.254: D.ZZ1.A 62.59,14.24 R.ZZ1.1
N$37  (via drill 0.25)
  Top 0.254: v21.34,5.41 21.3,5.45 U.YY1.11
  Bottom 0.254: v21.34,5.41 21.29,5.47 20.61,5.47 20.3,5.78 C.YY2.1
N$38  (via drill 0.25)
  Top 0.254: U.YY1.6 16,5.45 16.05,5.4 16.97,5.4 v16.98,5.38
  Bottom 0.254: C.YY3.2 15.85,5.6 16.06,5.38 v16.98,5.38
N$42
  Top 0.254: X.DS1.P$3 78.23,35.03 78.23,32.73 R.DS2*.1
N$48  (via drill 0.25)
  Top 0.254: v12.01,18.06 12.77,18.06 13.78,19.08 14.45,19.08 15.05,18.47 15.05,17.8 v15.19,17.65
  Bottom 0.254: R.BC2.2 8.52,15.7 R.BC1.1 9.42,16.36 9.42,17.97 9.6,18.15 10.85,18.15 10.94,18.06 v12.01,18.06 | v15.19,17.65 15.19,17.35 15.93,16.61 15.93,15.99 15.17,15.23 U.BC1.NTC
N$50  (via drill 0.25)
  Top 0.381: v87.38,38.02 87.45,37.95 C.DS5.2
  Bottom 0.381: U.DS2.5 86.64,39.09 86.87,38.86 86.87,38.02 | 86.87,38.02 86.87,33.1 L.DS1.P$1 | 86.87,38.02 v87.38,38.02
N$51  (via drill 0.25)
  Top 0.381: C.DS10.2 87.16,33.53 v85.57,33.53 | Q.DS2.A 85.96,30.63 85.57,31.01 v85.57,33.53 | TP2.TP 85.57,34.47 v85.57,33.53
  Bottom 0.381: L.DS1.P$2 84.09,33.26 | 84.09,33.26 84.35,33.53 v85.57,33.53 | C.DS6.1 C.DS8.1 81.66,37.33 82.3,37.33 | U.DS2.1 82.3,38.14 82.3,37.33 | 82.3,37.33 82.3,34.54 82.55,34.29 83.82,34.29 84.09,34.02 84.09,33.26
N$52  (via drill 0.25)
  Top 0.254: SJ.BC1.2 13.72,11.48 12.75,12.45 v12.7,12.45 v10.23,12.45
  Bottom 0.254: U.BC1.VCC v12.71,12.45 v12.7,12.45 | C.BC2.2 9.53,12.06 9.85,12.06 v10.23,12.45 10.23,12.68 10.19,12.72 10.19,13.44 9.74,13.88 R.BC1.2
N$56  (via drill 0.25)
  Top 0.254: L.BC1.P$2 13.97,18.29 v14.22,18.54
  Bottom 0.254: R.BC3.1 14.73,18.8 14.48,18.54 v14.22,18.54 13.21,17.53 U.BC1.CSP
N$58  (via drill 0.25)
  Top 0.254: SJ.BC1.1 11.96,11.18 v11.3,11.84
  Bottom 0.254: v11.3,11.84 11.3,13.08 11.1,13.28 11.1,14.15 11.18,14.23 U.BC1.SEL
N$59  (via drill 0.25)
  Top 0.254: v15.82,14.29 15.82,14.01 14.78,12.55 v14.73,11.94
  Bottom 0.254: U.BC1.BST 15.26,14.23 15.27,14.25 15.77,14.25 v15.82,14.29 | v14.73,11.94 14.73,11.04 C.BC1.1
N$60  (via drill 0.25)
  Top 0.254: v12.18,12.98 10.9,12.98 10.37,13.51 L.BC1.P$1
  Bottom 0.254: U.BC1.SW 13.72,13.03 14,12.75 14,12 C.BC1.2 12.17,11.67 12.17,12.67 12.18,12.67 v12.18,12.98
RAWSENSE  (via drill 0.25)
  Top 0.254: v52.07,13.97 54.24,11.8 54.24,10.71 52.45,8.92 v52.45,7.74 | v30.48,28.19 30.48,31.75 28.05,34.18 v27.43,34.18
  Bottom 0.254: v52.07,13.97 52.07,14.35 52.49,14.77 52.49,15.4 53.31,16.21 U.ESP1.6 | R.VI2.1 26.07,33.27 25.57,33.78 R.VI3.2 27.04,33.78 v27.43,34.18 | v30.48,28.19 30.48,26.68 30.36,26.56 30.36,25.25 31.29,24.33 34.08,24.33 36.35,22.06 36.35,20.3 36.45,20.2 40.78,20.2 40.99,19.99 40.99,12.76 42.62,11.12 42.62,7.41 42.22,7 42.22,5.01 45.12,2.11 47.07,2.11 52.45,7.49 v52.45,7.74
RESET  (via drill 0.25)
  Top 0.254: v56.26,14.19 56.56,14.49 56.82,14.7 56.83,14.7 60.61,17.01 61.29,17.4 62.05,17.4 63.75,19.1 63.75,19.69 64.33,20.28 67.52,22.18 | 67.52,22.18 67.63,22.24 68.75,23.37 R.ESP2.2 | X.ESP6.P$1 69.92,19.78 67.52,22.18
  Bottom 0.254: U.ESP1.3 56.23,14.22 v56.26,14.19
SERVO1  (via drill 0.25)
  Top 0.254: v57.66,17.53 57.4,17.53 57.02,17.14 56,17.09 R.SI1*.2
  Bottom 0.254: U.ESP1.37 70.06,20.1 69.05,20.1 66.47,17.53 58.38,17.53 58.36,17.51 58.3,17.53 v57.66,17.53
SERVO2  (via drill 0.25)
  Top 0.254: v53.52,22.17 54.28,22.94 R.SI2*.2
  Bottom 0.254: v53.52,22.17 51.41,20.91 U.ESP1.10
SYS_POWER  (via drill 0.25, 0.35)  (14 unrouted)
  Top 0.254: U.YY1.7 16.46,4.95 16.84,4.57 18.16,4.57 18.54,4.95 U.YY1.10 21.05,4.95 21.12,4.88 21.64,4.88 v22.61,5.84 | R.YY2.2 51.96,15.24 v51.31,15.24
  Top 0.508: v85.55,40.78 85.55,40.44 86.11,39.88 87.54,39.88 C.DS9.2 87.88,39.66 v87.88,38.86 | C.SI1.2 48.54,19.33 SV2.2
  Bottom 0.254: C.YY4.1 v22.61,5.84
  Bottom 0.508: U.DS2.2 U.DS2.3 83.08,40.65 v82.83,40.89 85.44,40.89 v85.55,40.78 | C.DS7.1 87.86,38.89 v87.88,38.86
  other vias: 26.67,12.45 26.16,11.94 25.65,11.43 25.15,10.92 24.64,10.41
  cutout Route2: 56.64,9.65 72.24,18.72 76.66,11.05 61.11,1.98
  pour Top (no thermals): 25.15,15.24 22.1,12.19 22.1,11.68 23.62,10.16 24.64,10.16 27.18,12.7 27.18,13.72 25.65,15.24
  pour Route15 (rank 4, no thermals): 7.62,30.99 7.37,31.24 arc-180 12.45,36.32 13.97,34.8 28.19,34.8 35.05,30.73 35.05,27.43 arc180 46.23,27.43 46.23,30.73 60.48,38.91 arc140 71.12,41.4 71.12,42.67 88.9,42.67 88.9,38.35 90.93,38.35 arc-180 90.93,31.24 88.65,31.24 88.65,22.61 87.12,22.61 83.31,18.8 82.16,18.8 arc-38 51.05,1.27 49.78,0 39.62,0 39.37,0.25 arc-11 25.15,2.29 21.08,3.3 13.21,3.3 13.21,8.13 12.45,8.89 10.67,8.89 7.62,11.94
SYS_SENSE  (via drill 0.25)
  Top 0.254: v51.71,16.13 51.65,16.2 51.65,17.25 R.YY2.1 | R.YY1.2 50.72,20.49 51.35,21.12 51.35,21.38 51.41,21.62 51.22,21.96 51.26,22.12 51.37,22.18 v52.25,22.88
  Bottom 0.254: v51.71,16.13 51.71,17.17 52.15,17.61 U.ESP1.7 53.17,17.61 53.62,18.06 55.49,18.06 55.8,18.37 55.8,19.37 55.09,20.08 55.09,21.41 53.79,22.71 52.43,22.71 v52.25,22.88
VBAT  (via drill 0.25)  (1 unrouted)
  Top 0.254: v17.7,23.93 14.48,23.93 X.BI1.1 12.45,23.62 10.87,22.04 9.56,22.04 8.63,22.97 8.63,26.05 11.68,29.1 v11.68,30.23 TP1.TP | v17.14,24.87 17.53,25.25 C.BI1.1
  Top 0.381: v46.08,24.18 49.25,27.36 Q.ZZ3.A | v39.84,21.27 37.27,21.27 34.31,24.23 31.29,24.23 30.26,25.25 30.26,26.66 28.9,28.02 23.57,28.02 21.71,26.16 19.13,26.16 19.04,26.07 18.55,26.07 C.BI1.1
  Bottom 0.254: v11.68,30.23 10.84,30.23 Q.BI2.2 | Q.YY1.P$1 17.62,24.01 v17.7,23.93 | v17.7,23.93 v17.7,24.43 17.58,24.43 v17.14,24.87 | v17.7,23.93 v17.7,23.42 17.4,23.11 v17.14,23.11 | X.BI1.1 14.73,23.06 R.BC3.2 C.BC4.1 12.7,20.95 13.5,20.15 13.5,18.79 12.71,18 U.BC1.BAT | v39.84,21.27 39.91,21.27
  Bottom 0.381: 39.91,21.27 39.91,21.26 43.28,21.26 45.82,23.8 v46.08,24.18
  other vias: 16.26,23.98
  pour Top (no thermals): 12.7,22.5 12.7,24.74 13.11,25.15 17.53,25.15 18.03,24.64 18.03,23.37 17.53,22.86 16.26,22.86 15.49,22.1 13.11,22.1
  pour Bottom (no thermals): 12.7,22.5 12.7,24.74 13.11,25.15 17.53,25.15 18.03,24.64 18.03,23.37 17.53,22.86 16.26,22.86 15.49,22.1 13.11,22.1
VCONV  (via drill 0.25)
  Top 0.254: TP4.TP 26.11,23.43 25.85,23.17 24.95,23.17 R.EC1.1 22.87,23.35 v22.86,23.37 | v23.37,18.03 23.37,17.52 23.41,17.48 23.41,16.8 v23.11,16.51
  Top 0.381: Q.ZZ1.A 51.75,25.43 51.29,25.88 48.57,25.88 47.03,24.35 46.93,24.17 44.94,22.18 44.19,22.36 43.26,21.82 42.24,21.45 42.06,21.26 40.82,21.26 39.62,20.07 35.31,20.07 34.54,19.3 34.54,15.24 33.78,14.48 C.EC6.P$2
  Top 0.889: C.EC6.P$2 30,14.1 27.69,14.1 25.27,16.51 v24.64,16.51
  Bottom 0.254: v23.37,18.03 22.86,18.54 v22.86,18.8 v22.86,19.81 v22.86,20.83 v22.86,21.84 | v22.86,21.84 v22.1,21.84 | v22.1,22.61 v22.86,22.61 | v22.86,22.61 v22.86,21.84 | v22.86,22.61 v22.86,23.37 v22.1,23.37 v22.1,24.13 21.69,24.54 21.69,25.04 | 20.52,23.07 21.39,23.07 21.57,23.24 21.57,24.92 21.69,25.04 | 20.52,23.07 20.34,23.24 20.34,23.39 v20.24,23.49 v20.24,24 | v21.72,25.07 21.69,25.04 | v20.24,24 v20.24,24.51 19.84,24.92 v19.69,24.92 | v19.66,23.06 v19.66,23.07 20.52,23.07 | v20.24,24 Q.YY1.P$3 | U.EC1.8 v22.86,22.61
  Bottom 1.016: v23.11,16.51 23.11,15.49 22.95,15.33 C.EC7.2 | C.EC5.1 24.13,13.41 24.13,16.26 v23.88,16.51
  pour Bottom: 26.16,17.27 24.13,17.27 23.88,17.53 23.88,21.59 24.13,21.84 26.16,21.84 26.16,23.37 24.13,23.37 21.84,25.65 19.56,25.65 19.3,25.4 19.3,22.35 21.59,20.07 21.59,16.92 22.76,15.75 26.16,15.75
  pour Top: 19.3,23.37 19.3,25.15 19.81,25.65 21.84,25.65 23.88,23.62 23.88,17.53 24.13,17.02 25.15,17.02 25.15,15.75 22.76,15.75 21.59,16.92 21.59,20.73 19.3,23.01
VPROG
  Top 0.381: Q.ZZ2.A 65.98,20.32 68.67,20.32 70.11,18.88 77.05,18.88 78.98,20.81 78.98,22.85 79.76,23.62 | 79.76,23.62 78.2,23.62 77.72,24.1 76.75,24.1 76.15,23.49 X.ESP6.P$6 | 79.76,23.62 79.88,23.75 80.57,24.44 Q.DS1.A
VRAW  (via drill 0.25)
  Top 0.254: v13.44,12.53 14.4,13.5 14.77,13.5 15.05,13.78 15.05,14.28 15.59,14.83 16.32,14.83 v16.36,14.78 | v28.45,29.97 28.45,31.08 R.VI1.2 27.77,32.93 v27.69,33.02 | v18.59,16.53 18.11,16.05 v17.47,16.05
  Bottom 0.127: X.VI1.2 28.81,25.04 U.EC1.11 | 28.81,20.83 28.81,17.53 U.EC1.22
  Bottom 0.254: C.VI3.1 31.45,28.25 30.67,29.02 Q.VI1.1 28.45,29.02 | U.BC1.VIN 13.23,13.56 13.23,12.83 13.44,12.62 v13.44,12.53 | C.EC2.2 27.85,29.02 28.45,29.02 | v16.36,14.78 16.82,14.78 17.17,15.14 C.BC3.1 17.29,15.86 v17.47,16.05 | C.EC4.+ 27.42,9.15 26.89,8.62 25.68,8.62 21.47,12.83 21.47,13.78 21.1,14.15 20.9,14.15 20.3,14.76 20.3,15.92 19.84,16.38 18.75,16.38 v18.59,16.53 | v28.45,29.97 28.45,29.02 | R.VI2.2 27.69,32.09 v27.69,33.02 | U.EC1.11 28.81,20.83 | U.EC1.22 28.81,16.76 | U.EC1.11 28.81,22.41 v28.85,22.45 | U.EC1.11 28.85,21.66 v28.85,20.68 | U.EC1.22 28.81,18.59 v28.85,18.64 | U.EC1.22 28.85,17.36 v28.85,16.61
  Bottom 0.508: C.EC2.2 27.79,26.06 X.VI1.2
  Bottom 1.016: 32.84,13.28 33.1,13.03 35.2,15.14 C.EC1.2 | 32.84,13.28 32.16,13.97 30.23,13.97 28.81,15.39 28.81,16.76 28.81,17.53 | C.EC3.+ 32.77,9.91 | 32.77,9.91 32.77,13.21 32.84,13.28 | C.EC4.+ 31.24,9.91 32.77,9.91
  pour Bottom (no thermals): 28.12,23.52 arc70 27.38,24.77 arc-102 26.9,26.62 arc-119 29.11,26.39 arc-24 29.51,24.56 arc-1 29.51,23.34 arc-181 28.12,23.37
  pour Top (no thermals): 28.12,23.42 arc70 27.38,24.75 arc-102 26.9,26.61 arc-119 29.11,26.38 arc-24 29.52,24.55 29.51,23.39 29.51,15.6 28.09,15.6 28.12,23.41
  pour Bottom: 28.17,15.75 28.17,14.77 29.9,13.46 31.5,13.46 32.26,12.7 32.26,9.65 32.77,9.14 33.27,9.14 33.27,13.61 32.21,14.73 30.23,14.73 29.46,15.49 29.46,15.75

## Text on the board
tPlace: VRAW | GND | BAT2 | MB | VBAT | GND | SYS | 2022 01 05 | SIG | EVPR MKII H | Peter McCloud / Georges Oates Larsen | SYS | GND | MCCLOUD AERO | Concept & HW Design: / PCB Design: / Many² thanks to Andrew Greenberg
bPlace: BAT1 | MB | GND | MB | VB | GND | SYS | SIG | SYS | GND